# Altium schematic sheet Power_CAN_IO_GPS.SchDoc
size A2
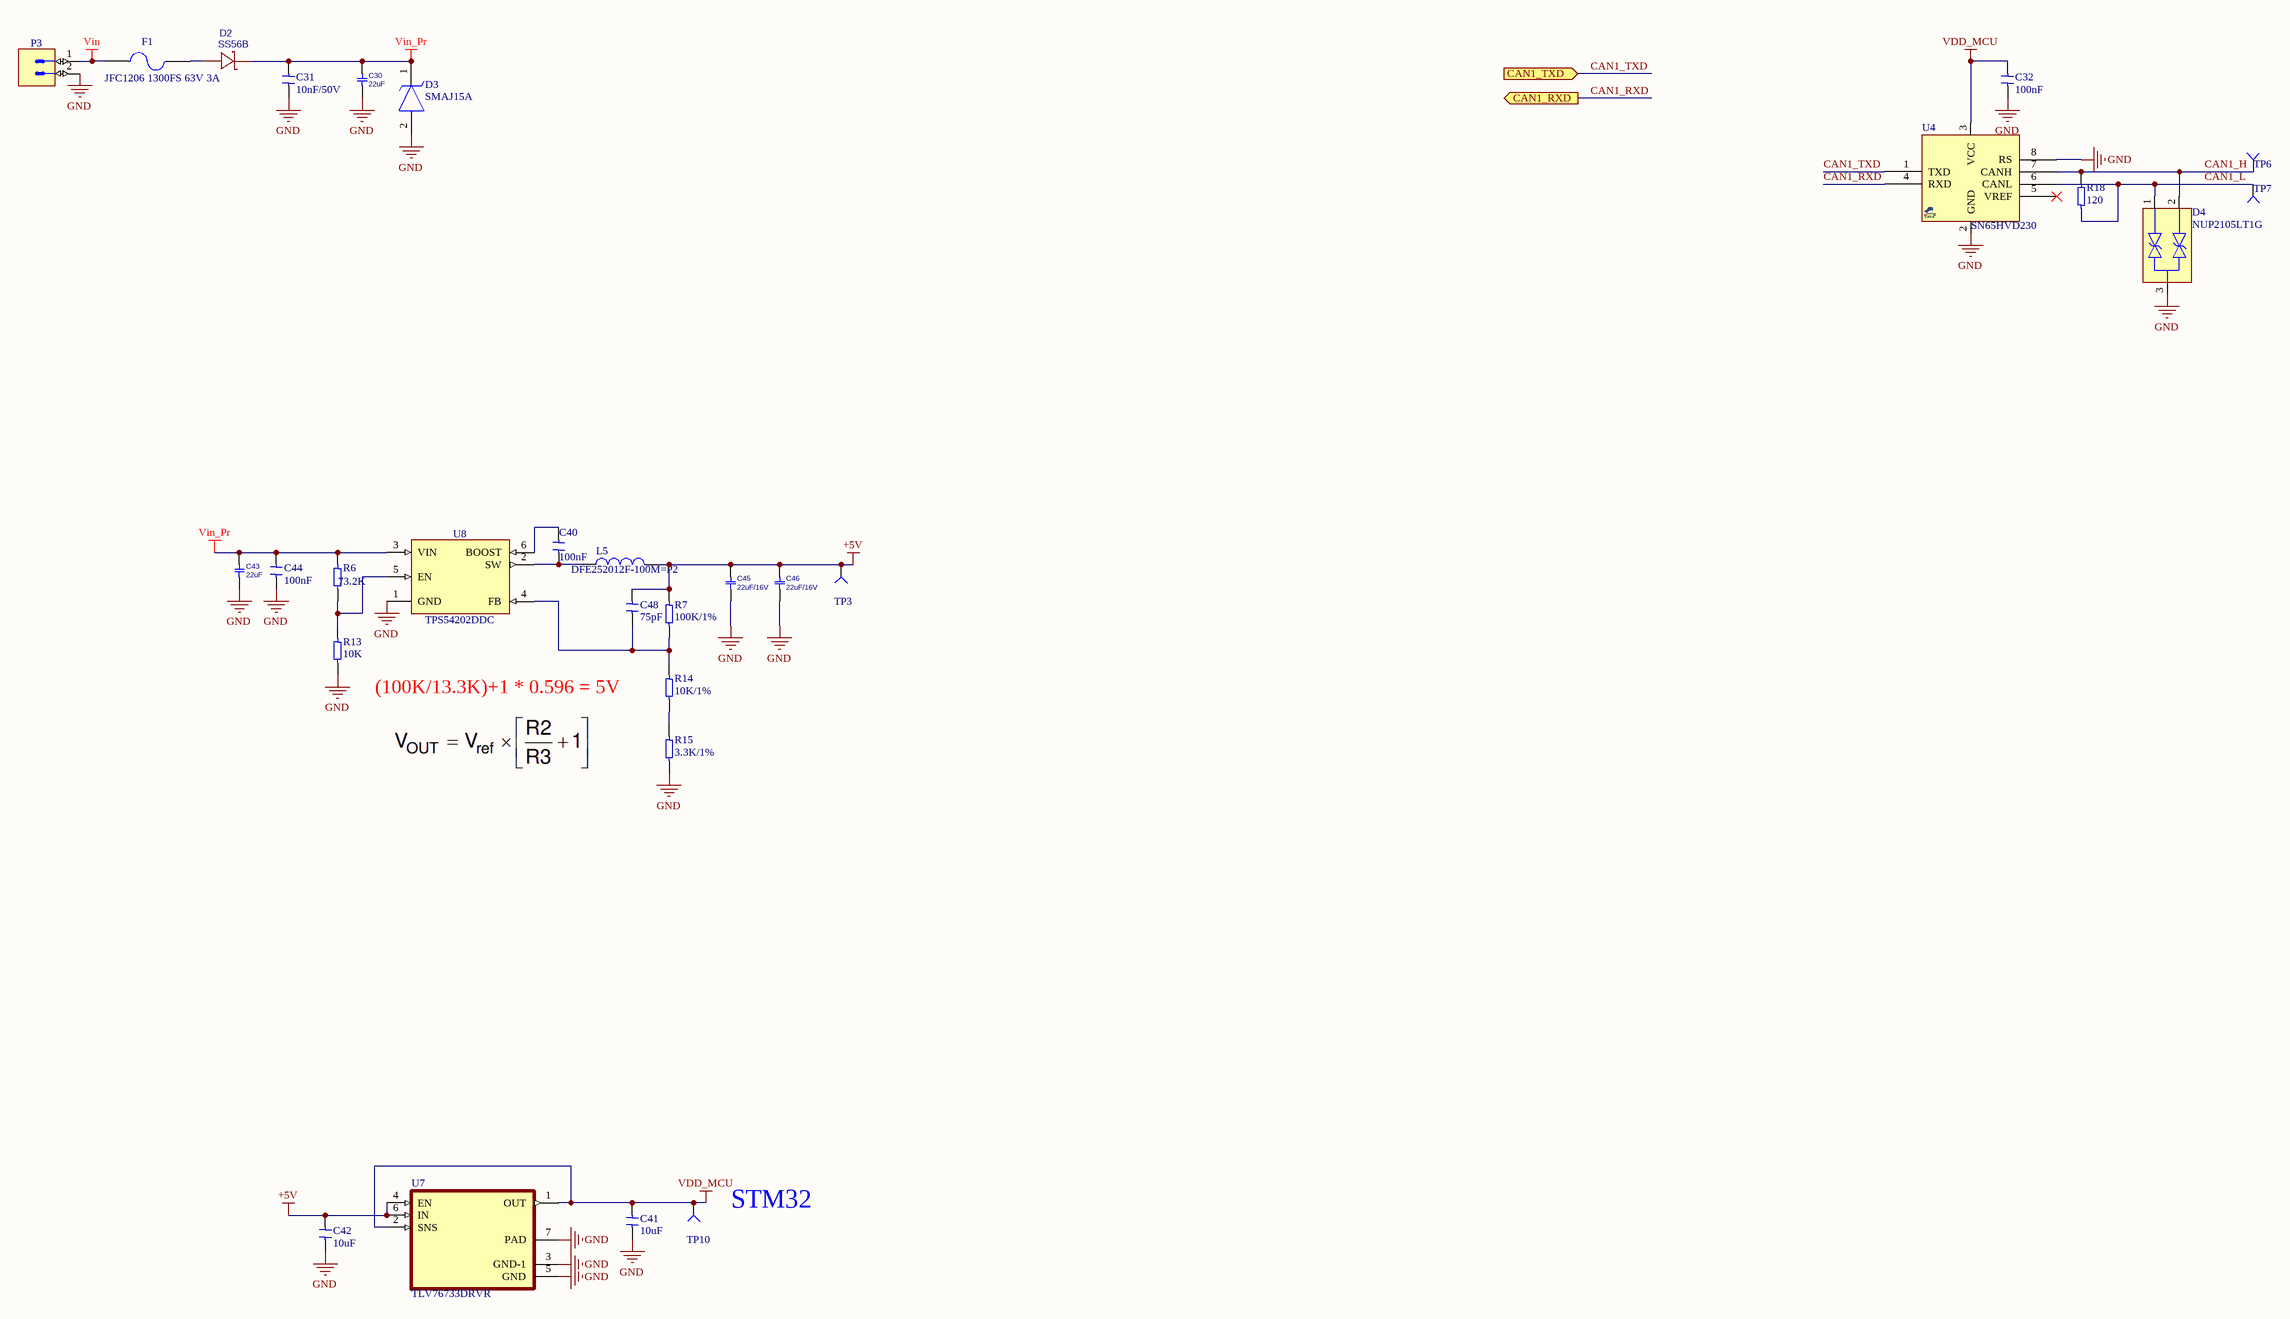
[diagram p0: Power_CAN_IO_GPS.SchDoc]

## Parts
C30  22uF  [C1206E]
C31  10nF/50V  [C0603E]
C32  100nF  [C0603E]
C40  100nF  [C0603E]
C41  10uF  [C0603E]
C42  10uF  [C0603E]
C43  22uF  [C1206E]
C44  100nF  [C0603E]
C45  22uF/16V  [C1206E]
C46  22uF/16V  [C1206E]
C48  75pF  [C0603E]
D2  SS56B  [SMB_L4.6-W3.6-LS5.3-RD]
D3  SMAJ15A  [DIOM5026X229N]
D4  NUP2105LT1G  [SOT95P237X111-3N]
F1  JFC1206 1300FS 63V 3A  [1206 FUSE]
L5  DFE252012F-100M=P2  [INDC2520X120N]
P3  KF2EDGV+K-3.81-2P  [PHOENIX_1803426]  (value not drawn)
R6  73.2K  [R0603E]
R7  100K/1%  [R0603E]
R13  10K  [R0603E]
R14  10K/1%  [R0603E]
R15  3.3K/1%  [R0603E]
R18  120  [R0603E]
TP3  TEST POINT  [TEST_POINT]  (value not drawn)  (no BOM)
TP6  TEST POINT  [TEST_POINT]  (value not drawn)  (no BOM)
TP7  TEST POINT  [TEST_POINT]  (value not drawn)  (no BOM)
TP10  TEST POINT  [TEST_POINT]  (value not drawn)  (no BOM)
U4  SN65HVD230  [SO_8]
U7  TLV76733DRVR  [SON65P200X200X80-7N]
U8  TPS54202DDC  [SOT95P280X100-6N]

## Ports
CAN1_RXD (out), CAN1_TXD (in)

## Nets
+5V: C42.2 C45.2 C46.2 C48.2 L5.2 R7.1 TP3.1(TP) U7.4(EN) U7.6(IN)
GND: C30.1 C31.1 C32.1 C41.1 C42.1 C43.1 C44.1 C45.1 C46.1 D3.2(A) D4.3 P3.2 R13.2 R15.2 U4.2(GND) U4.8(RS) U7.3(GND-1) U7.5(GND) U7.7(PAD) U8.1(GND)
VDD_MCU: C32.2 C41.2 TP10.1(TP) U4.3(VCC) U7.1(OUT) U7.2(SNS)
Vin: F1.1 P3.1
Vin_Pr: C30.2 C31.2 C43.2 C44.2 D2.1(K) D3.1(K) R6.1 U8.3(VIN)
CAN1_H: D4.2 R18.2 TP6.1(TP) U4.7(CANH)
CAN1_L: D4.1 R18.1 TP7.1(TP) U4.6(CANL)
CAN1_RXD: U4.4(RXD) ; port CAN1_RXD
CAN1_TXD: U4.1(TXD) ; port CAN1_TXD
NetC40_1: C40.1 U8.6(BOOST)
NetC40_2: C40.2 L5.1 U8.2(SW)
NetC48_1: C48.1 R7.2 R14.1 U8.4(FB)
NetD2_2: D2.2(A) F1.2
NetR6_2: R6.2 R13.1 U8.5(EN)
NetR14_2: R14.2 R15.1

Not connected (* = marked no-connect by the designer): U4 5(VREF)*

## Notes on the sheet
- (100K/13.3K)+1 * 0.596 = 5V
- (near TP10) STM32

## Library data of the parts
C30 C43 C45 C46 = CAP_SMD_MLCC_22u25V: CAP, MLCC, X5R 22uF 25V 20% 1206; PARAM: X5R, 20%; MANF_P#: TMK316BBJ226ML-T; MANF: Taiyo Yuden; DESC: CAP, MLCC, 22uF, 25V, X5R,  20%, 1206; PARAM2: 25V; PRICE: 0.572$
  C30 C43: VALUE: 22uF
  C45 C46: VALUE: 22uF/16V
C31 C32 C40-C42 C44 C48 = Capacitor SMD
  C31: Value: 10nF/50V
  C32 C40 C44: Value: 100nF
  C41 C42: Value: 10uF
  C48: Value: 75pF
D2 = SS54C: 40V 5A Schottky Rectifier; Manufacturer: LGE(鲁光); Manufacturer Part: SS54; Contributor: LCSC; Supplier: LCSC; Supplier Part: C330398; JLCPCB Part Class: Extended Part; spicePre: D; spiceSymbolName: SS54C
D3 = SMAJ24A: TVS Diode (Uni-directional); Manufacturer_Name: LITTELFUSE; Datasheet Link: https://componentsearchengine.com/Datasheets/2/SMAJ24A.pdf; Height: 2.29mm; Manufacturer_Part_Number: SMAJ24A; Mouser Part Number: 576-SMAJ24A; Mouser Price/Stock: https://www.mouser.co.uk/ProductDetail/Littelfuse/SMAJ24A?qs=HR2RnyOI4E78ZevQKM2hdA%3D%3D; Arrow Part Number: SMAJ24A; Arrow Price/Stock: https://www.arrow.com/en/products/smaj24a/littelfuse?region=nac
D4 = NUP2105LT1G: Dual Bi-Directional TVS Diode 350W 3-Pin SOT-23 | ON Semiconductor NUP2105LT1G; SnapEDA_Link: https://www.snapeda.com/parts/NUP2105LT1G/Onsemi/view-part/?ref=snap; Package: SOT-23-3 ON Semiconductor; Value: *; MF: ON Semiconductor; MP: NUP2105LT1G; Check_prices: https://www.snapeda.com/parts/NUP2105LT1G/Onsemi/view-part/?ref=eda
F1 = Fuse SMD1206: Fuse Type Fast Acting with 63V, 3A, 1206; Designer: Abbas Basereh; Desc.: SMD Fuses 1206; Data: 16-12-2016
L5 = DFE252012F-100M=P2: Inductor with Inductance: 10uH Tol. +/-20%, Package: 1008 (2520); MF: Murata Electronics; SnapEDA_Link: https://www.snapeda.com/parts/DFE252012F-100M=P2/Murata%20Electronics%20North%20America/view-part/1498782/?ref=snap; Value: *; Digi-Key_Part_Number: 490-13050-1-ND; Mouser-Purchase-URL: https://snapeda.com/shop?store=Mouser&id=1498782; MP: DFE252012F-100M=P2; DigiKey-Purchase-URL: https://snapeda.com/shop?store=DigiKey&id=1498782; Package: 2520 Murata; Check_prices: https://www.snapeda.com/parts/DFE252012F-100M=P2/Murata%20Electronics%20North%20America/view-part/1498782/?ref=eda
P3 = PHOENIX_1803426: Connector 2 Male; Part Description: 8A 160 V, Pitch: 3.81mm, 2 Positions Header; Manufacturer: PHOENIX CONTACT; Manufacturer Part Number: 1803426 (MCV 1,5/2-G-3,81); PressFit: No; Part Number: PHOENIX_1803426; Component Kind: Standard; Component Type: Standard; Pin Count: 2; Mounted: Yes; Socket: No; SMD: No; Sense: No; Status: None; ComponentHeight: 9.2mm; HelpURL: \\cern.ch\dfs\Applications\Altium\Datasheets\PHOENIX_1803426.pdf; Author: CERN DEM JLC; CreateDate: 5/4/2010; LatestRevisionDate: 5/4/2010
R6 R7 R13-R15 R18 = Resistor SMD
  R6: Value: 73.2K
  R7: Value: 100K/1%
  R13: Value: 10K
  R14: Value: 10K/1%
  R15: Value: 3.3K/1%
  R18: Value: 120
TP3 TP6 TP7 TP10 = TEST POINT: Board Qty: 100; PCB Name: Main_PCB
U4 = SN65HVD230_SOP8: CAN,  Transceivers, 3.3V (VDD); MANF: Texas Instruments; MANF_P#: SN65HVD230D, SN65HVD230QD; PARAM: -40~85oC; PRICE: 2.3$@MOUSER; PARAM2: 3.3V (VDD); VALUE: SN65HVD230
U7 = TLV76733DRVR: Adjustable- and fixed-output, 1-A, 16-V, positive-voltage low-dropout (LDO) linear regulator; MF: Texas Instruments; SnapEDA_Link: https://www.snapeda.com/parts/TLV76733DRVR/Texas+Instruments/view-part/?ref=snap; Package: WSON-6 Texas Instruments; Value: *; MP: TLV76733DRVR; Check_prices: https://www.snapeda.com/parts/TLV76733DRVR/Texas+Instruments/view-part/?ref=eda
U8 = TPS54202DDC: 4.5V to 28V Input, 2-A Output, EMI Friendly / Synchronous Step Down Converter; Part Description: 4.5V to 28V Input, 2A Output, EMI Friendly Synchronous Step Down Converter; Manufacturer: TEXAS INSTRUMENTS; PressFit: No; Bonding: No; Part Number: TPS54202DDC; Component Kind: Standard; Component Type: Standard; Device: TPS54202DDC; PackageDescription: SOT23, 0.95mm Pitch; 6 Pin, 1.625mm W X 2.90mm L X 1.00mm H body, IPC Medium Density; Manufacturer Part Number: TPS54202DDC; Pin Count: 5; Case: SOT23-6; Mounted: Yes; Socket: No; SMD: Yes; Sense: No; ComponentHeight: 1.1mm; HelpURL: \\cern.ch\dfs\Applications\Altium\Datasheets\TPS54202.pdf; Author: CERN DEM HF; CreateDate: 6/10/2022; LatestRevisionDate: 6/10/2022